# Altium schematic sheet SH2-Differential I2C.SchDoc
size Letter
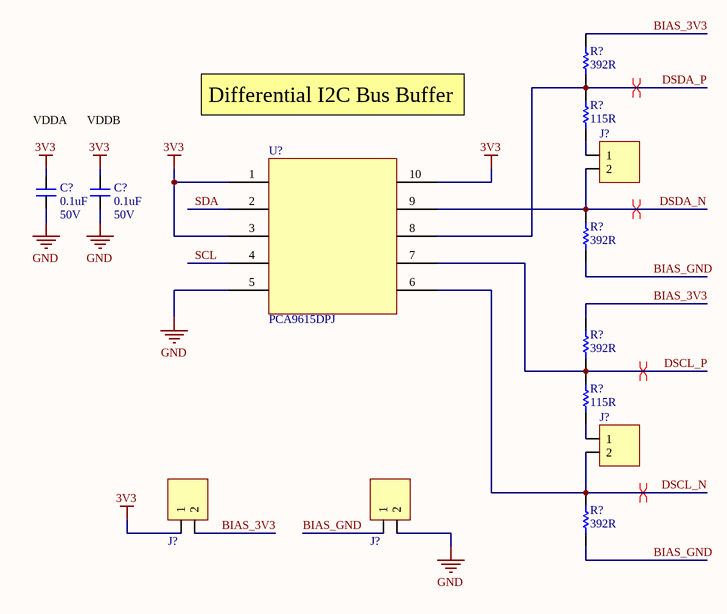
[diagram p0: SH2-Differential I2C.SchDoc]

## Parts
(Parts that share a designator on the sheet are numbered #1, #2 ... from top to bottom, then left to right.)
C?#1  value 0.1uF  Voltage Rating: 50V  [CAPC2012X140N]  (hidden comment: CAP_0.1uF_50V_0805)
C?#2  value 0.1uF  Voltage Rating: 50V  [CAPC2012X140N]  (hidden comment: CAP_0.1uF_50V_0805)
J?#1  JUMPER_2  [HDR1X2]  (value not drawn)
J?#2  JUMPER_2  [HDR1X2]  (value not drawn)
J?#3  JUMPER_2  [HDR1X2]  (value not drawn)
J?#4  JUMPER_2  [HDR1X2]  (value not drawn)
R?#1  Resistance: 392R  [RESC2012X60N]  (hidden comment: RES_392R_0805)
R?#2  Resistance: 115R  [RESC2012X60N]  (hidden comment: RES_115R_0805)
R?#3  Resistance: 392R  [RESC2012X60N]  (hidden comment: RES_392R_0805)
R?#4  Resistance: 392R  [RESC2012X60N]  (hidden comment: RES_392R_0805)
R?#5  Resistance: 115R  [RESC2012X60N]  (hidden comment: RES_115R_0805)
R?#6  Resistance: 392R  [RESC2012X60N]  (hidden comment: RES_392R_0805)
U?  DIFF_I2C_BUFFER  [PCA9615DPJ]  (value not drawn)

## Nets
3V3: C?#1.2 C?#2.2 J?#3.1 U?.1(VDDA) U?.3(EN) U?.10(VDDB)
GND: C?#1.1 C?#2.1 J?#4.2 U?.5(VSS)
BIAS_3V3: J?#3.2 R?#1.2 R?#4.2
BIAS_GND: J?#4.1 R?#3.1 R?#6.1
DSCL_N: J?#2.2 R?#6.2 U?.6(DSCLM)
DSCL_P: R?#4.1 R?#5.2 U?.7(DSCLP)
DSDA_N: J?#1.2 R?#3.2 U?.9(DSDAM)
DSDA_P: R?#1.1 R?#2.2 U?.8(DSDAP)
SCL: U?.4(SCL)
SDA: U?.2(SDA)
NetJ?#1_1: J?#1.1 R?#2.1
NetJ?#2_1: J?#2.1 R?#5.1

## Layout directives
differential pair: DSCL_N, DSCL_P, DSDA_N, DSDA_P

## Notes on the sheet
- VDDA
- VDDB
- Differential I2C Bus Buffer
- Title
- Size:
- Date:
- Letter
- Drawn By:
- Sheet
- of
- File:

## Library data of the parts
C?#1 C?#2 = CAP_0.1uF_50V_0805: CAP CER 0.1UF 50V X7R 0805; Manufacturer 1: Murata Electronics; Manufacturer Part Number 1: GCD21BR71H104KA01L; Capacitance: 100nF; Tolerance: 10%; Supplier 1: Digi-Key; Mount: Surface Mount; Case/Package: 0805; Case Code (Metric): 2012; Case Code (Imperial): 0805; Min Operating Temperature: -55°C; Max Operating Temperature: 125°C; Dielectric: X7R; Termination: SMD/SMT; Length: 2mm; Height: 1.25mm; Width: 0.049inch; Thickness: 0.049inch; Depth: 1.25mm; Ratings: AEC-Q200; ComponentLink1URL: https://datasheet.ciiva.com/29537/c03e-29537701.pdf?src-supplier=Digi-Key; ComponentLink1Description: https://datasheet.ciiva.com/29537/c03e-29537701.pdf?src-supplier=Digi-Key; Supplier Part Number 1: 490-11955-1-ND
J?#1-J?#4 = JUMPER_2: HEADER 2X1; Manufacturer 1: TE Connectivity; Manufacturer Part Number 1: 87220-2; Supplier 1: Digi-Key; Supplier Part Number 1: A26542-ND; Mount: Through Hole
R?#1 R?#3 R?#4 R?#6 = RES_392R_0805: RES SMD 392 OHM 1% 1/8W 0805; Manufacturer 1: Yageo; Manufacturer Part Number 1: RC0805FR-07392RL; Max Power Dissipation: 125mW; Temperature Coefficient: 100ppm/°C; Voltage Rating (DC): 150V; Case Code (Imperial): 0805; Case Code (Metric): 2012; Case/Package: 0805; Category: Chip SMD Resistors; Composition: Thick Film; Depth: 1.25mm; Features: Moisture Resistant; Height: 0.024inch; Military Standard: Not; Max Operating Temperature: 155°C; Manufacturer Part Number: RC0805FR-07392RL; Length: 0.079inch; Lead Free: Lead Free; Min Operating Temperature: -55°C; Number of Terminations: 2; Package Quantity: 1; Packaging: Tape and Reel; Power Rating: 125mW; Tolerance: 1%; Width: 0.049inch; Supplier 1: Digi-Key; Supplier Part Number 1: 311-392CRCT-ND; Supplier Packaging 1: Cut Tape; Supplier Unit Price 1: 0.15 CAD; Supplier Location 1: US
R?#2 R?#5 = RES_115R_0805: RES SMD 115 OHM 1% 1/8W 0805; Manufacturer 1: Yageo; Manufacturer Part Number 1: RC0805FR-07115RL; Max Power Dissipation: 125mW; Temperature Coefficient: 100ppm/°C; Voltage Rating (DC): 150V; Case Code (Imperial): 0805; Case Code (Metric): 2012; Case/Package: 0805; Category: Chip SMD Resistors; Composition: Thick Film; Depth: 1.25mm; Features: Moisture Resistant; Height: 0.024inch; Military Standard: Not; Max Operating Temperature: 155°C; Manufacturer Part Number: RC0805FR-07115RL; Length: 0.079inch; Lead Free: Lead Free; Min Operating Temperature: -55°C; Number of Terminations: 2; Package Quantity: 1; Packaging: Tape and Reel; Power Rating: 125mW; Tolerance: 1%; Width: 0.049inch; Supplier 1: Digi-Key; Supplier Part Number 1: 311-115CRCT-ND; Supplier Packaging 1: Cut Tape; Supplier Unit Price 1: 0.14476 CAD; Supplier Location 1: US
U? = DIFF_I2C_BUFFER: IC DIFF I2C BUFFER 2CH 10TSSOP; Manufacturer 1: NXP Semiconductors; Number of Channels: 2; Operating Supply Current: 16uA; Input: 2-Wire Bus; Max Frequency: 1MHz; Supplier 1: Digi-Key; Stock 1: 4899; Pricing 1: 1=2.95000, 10=2.64900, 100=2.05930, 500=1.78100, 1000=1.48045 (USD); RoHS: Yes; Case/Package: 10-TSSOP; Number of Pins: 10; Min Operating Temperature: -40°C; Max Operating Temperature: 85°C; Packaging: Cut Tape; Package Quantity: 1; ComponentLink1URL: http://www.farnell.com/datasheets/2340284.pdf?src-supplier=Farnell; ComponentLink1Description: http://www.farnell.com/datasheets/2340284.pdf?src-supplier=Farnell; ComponentLink2URL: http://www.mouser.com/ds/2/302/PCA9615-841773.pdf?src-supplier=Mouser; ComponentLink2Description: http://www.mouser.com/ds/2/302/PCA9615-841773.pdf?src-supplier=Mouser; ComponentLink3URL: http://components.arrow.com/part/dataview/65281105S797392N7788?src-supplier=Arrow; ComponentLink3Description: http://components.arrow.com/part/dataview/65281105S797392N7788?src-supplier=Arrow; ComponentLink4URL: http://www.nxp.com/documents/data_sheet/PCA9615.pdf?src-supplier=Avnet; ComponentLink4Description: http://www.nxp.com/documents/data_sheet/PCA9615.pdf?src-supplier=Avnet; ComponentLink5Description: Digikey Link; ComponentLink5URL: https://www.digikey.ca/products/en/integrated-circuits-ics/interface-signal-buffers-repeaters-splitters/756?k=PCA9615&k=&pkeyword=PCA9615&sv=0&pv7=2&sf=0&FV=-8%7C756&quantity=&ColumnSort=0&page=1&pageSize=25; Supplier Part Number 1: 568-11484-1-ND; Mount: Surface Mount; Manufacturer Part Number 1: PCA9615DPJ